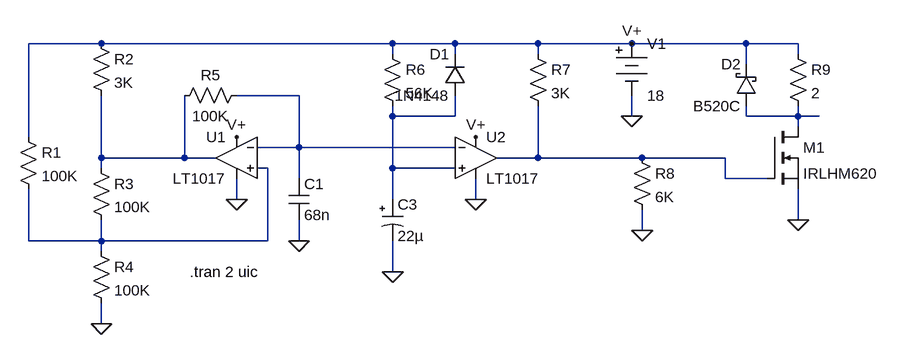
[diagram p0: schematic variable pwm generator.asc]
variable pwm generator.asc, the LTspice schematic file:
Version 4
SHEET 1 1224 680
WIRE -48 -64 -160 -64
WIRE 400 -64 -48 -64
WIRE 496 -64 400 -64
WIRE 624 -64 496 -64
WIRE 768 -64 624 -64
WIRE 944 -64 768 -64
WIRE 1024 -64 944 -64
WIRE 400 -48 400 -64
WIRE 496 -48 496 -64
WIRE 624 -48 624 -64
WIRE 1024 -48 1024 -64
WIRE 944 -32 944 -64
WIRE 256 16 160 16
WIRE 400 48 400 32
WIRE 496 48 496 16
WIRE 496 48 400 48
WIRE 768 48 768 16
WIRE 944 48 944 32
WIRE 1024 48 1024 32
WIRE 1024 48 944 48
WIRE 1056 48 1024 48
WIRE 1024 64 1024 48
WIRE -160 80 -160 -64
WIRE 256 96 256 16
WIRE 256 96 192 96
WIRE 496 96 256 96
WIRE -48 112 -48 16
WIRE 80 112 80 16
WIRE 80 112 -48 112
WIRE 128 112 80 112
WIRE 624 112 624 32
WIRE 624 112 560 112
WIRE 784 112 624 112
WIRE 912 112 784 112
WIRE -48 128 -48 112
WIRE 208 128 192 128
WIRE 400 128 400 48
WIRE 496 128 400 128
WIRE 256 144 256 96
WIRE 912 144 912 112
WIRE 976 144 912 144
WIRE 160 176 160 144
WIRE 400 176 400 128
WIRE 528 176 528 144
WIRE 1024 208 1024 160
WIRE 784 224 784 192
WIRE -160 240 -160 160
WIRE -48 240 -48 208
WIRE -48 240 -160 240
WIRE 208 240 208 128
WIRE 208 240 -48 240
WIRE 256 240 256 208
WIRE -48 256 -48 240
WIRE 400 288 400 240
WIRE -48 368 -48 336
FLAG -48 368 0
FLAG 160 176 0
FLAG 256 240 0
FLAG 400 288 0
FLAG 528 176 0
FLAG 768 -64 V+
FLAG 160 80 V+
FLAG 528 80 V+
FLAG 784 224 0
FLAG 768 48 0
FLAG 1024 208 0
SYMBOL res -176 64 R0
SYMATTR InstName R1
SYMATTR Value 100K
SYMBOL res -64 -80 R0
SYMATTR InstName R2
SYMATTR Value 3K
SYMBOL res -64 112 R0
SYMATTR InstName R3
SYMATTR Value 100K
SYMBOL res -64 240 R0
SYMATTR InstName R4
SYMATTR Value 100K
SYMBOL res 176 0 R90
WINDOW 0 0 56 VBottom 2
WINDOW 3 32 56 VTop 2
SYMATTR InstName R5
SYMATTR Value 100K
SYMBOL Comparators\\LT1017 160 112 M0
SYMATTR InstName U1
SYMBOL cap 240 144 R0
SYMATTR InstName C1
SYMATTR Value 68n
SYMBOL Comparators\\LT1017 528 112 R0
SYMATTR InstName U2
SYMBOL res 384 -64 R0
SYMATTR InstName R6
SYMATTR Value 56K
SYMBOL diode 512 16 R180
WINDOW 0 24 64 Left 2
WINDOW 3 24 0 Left 2
SYMATTR InstName D1
SYMATTR Value 1N4148
SYMBOL res 608 -64 R0
SYMATTR InstName R7
SYMATTR Value 3K
SYMBOL Misc\\battery 768 -80 R0
WINDOW 123 0 0 Left 0
WINDOW 39 0 0 Left 0
SYMATTR InstName V1
SYMATTR Value 18
SYMBOL res 768 96 R0
SYMATTR InstName R8
SYMATTR Value 6K
SYMBOL schottky 960 32 R180
WINDOW 0 24 64 Left 2
WINDOW 3 24 0 Left 2
SYMATTR InstName D2
SYMATTR Value B520C
SYMATTR Description Diode
SYMATTR Type diode
SYMBOL nmos 976 64 R0
SYMATTR InstName M1
SYMATTR Value IRLHM620
SYMBOL res 1008 -64 R0
SYMATTR InstName R9
SYMATTR Value 2
SYMBOL polcap 384 176 R0
WINDOW 3 24 56 Left 2
SYMATTR InstName C3
SYMATTR Value 22µ
SYMATTR Description Capacitor
SYMATTR Type cap
SYMATTR SpiceLine V=10 Irms=3.10529 Rser=0.028 Lser=0 mfg="KEMET" pn="A700V226M010ATE028" type="Al electrolytic"
TEXT 88 288 Left 2 !.tran 2 uic

The netlist it stands for:
* variable pwm generator.asc
R1 V+ N006 100K
R2 V+ N004 3K
R3 N004 N006 100K
R4 N006 0 100K
R5 N001 N004 100K
XU1 N006 N001 V+ 0 N004 LT1017  ; pins In+ In- V+ V- OUT
C1 N001 0 68n
XU2 N002 N001 V+ 0 N005 LT1017  ; pins In+ In- V+ V- OUT
R6 V+ N002 56K
D1 N002 V+ 1N4148
R7 V+ N005 3K
V1 V+ 0 18
R8 N005 0 6K
D2 N003 V+ B520C
M1 N003 N005 0 0 IRLHM620
R9 V+ N003 2
C3 N002 0 22µ V=10 Irms=3.10529 Rser=0.028 Lser=0 mfg="KEMET" pn="A700V226M010ATE028" type="Al electrolytic"
.model D D
.lib standard.dio
.model NMOS NMOS
.model PMOS PMOS
.lib standard.mos
.tran 2 uic
.backanno
.end